# EAGLE design Me507Project (EAGLE 7.7.0)
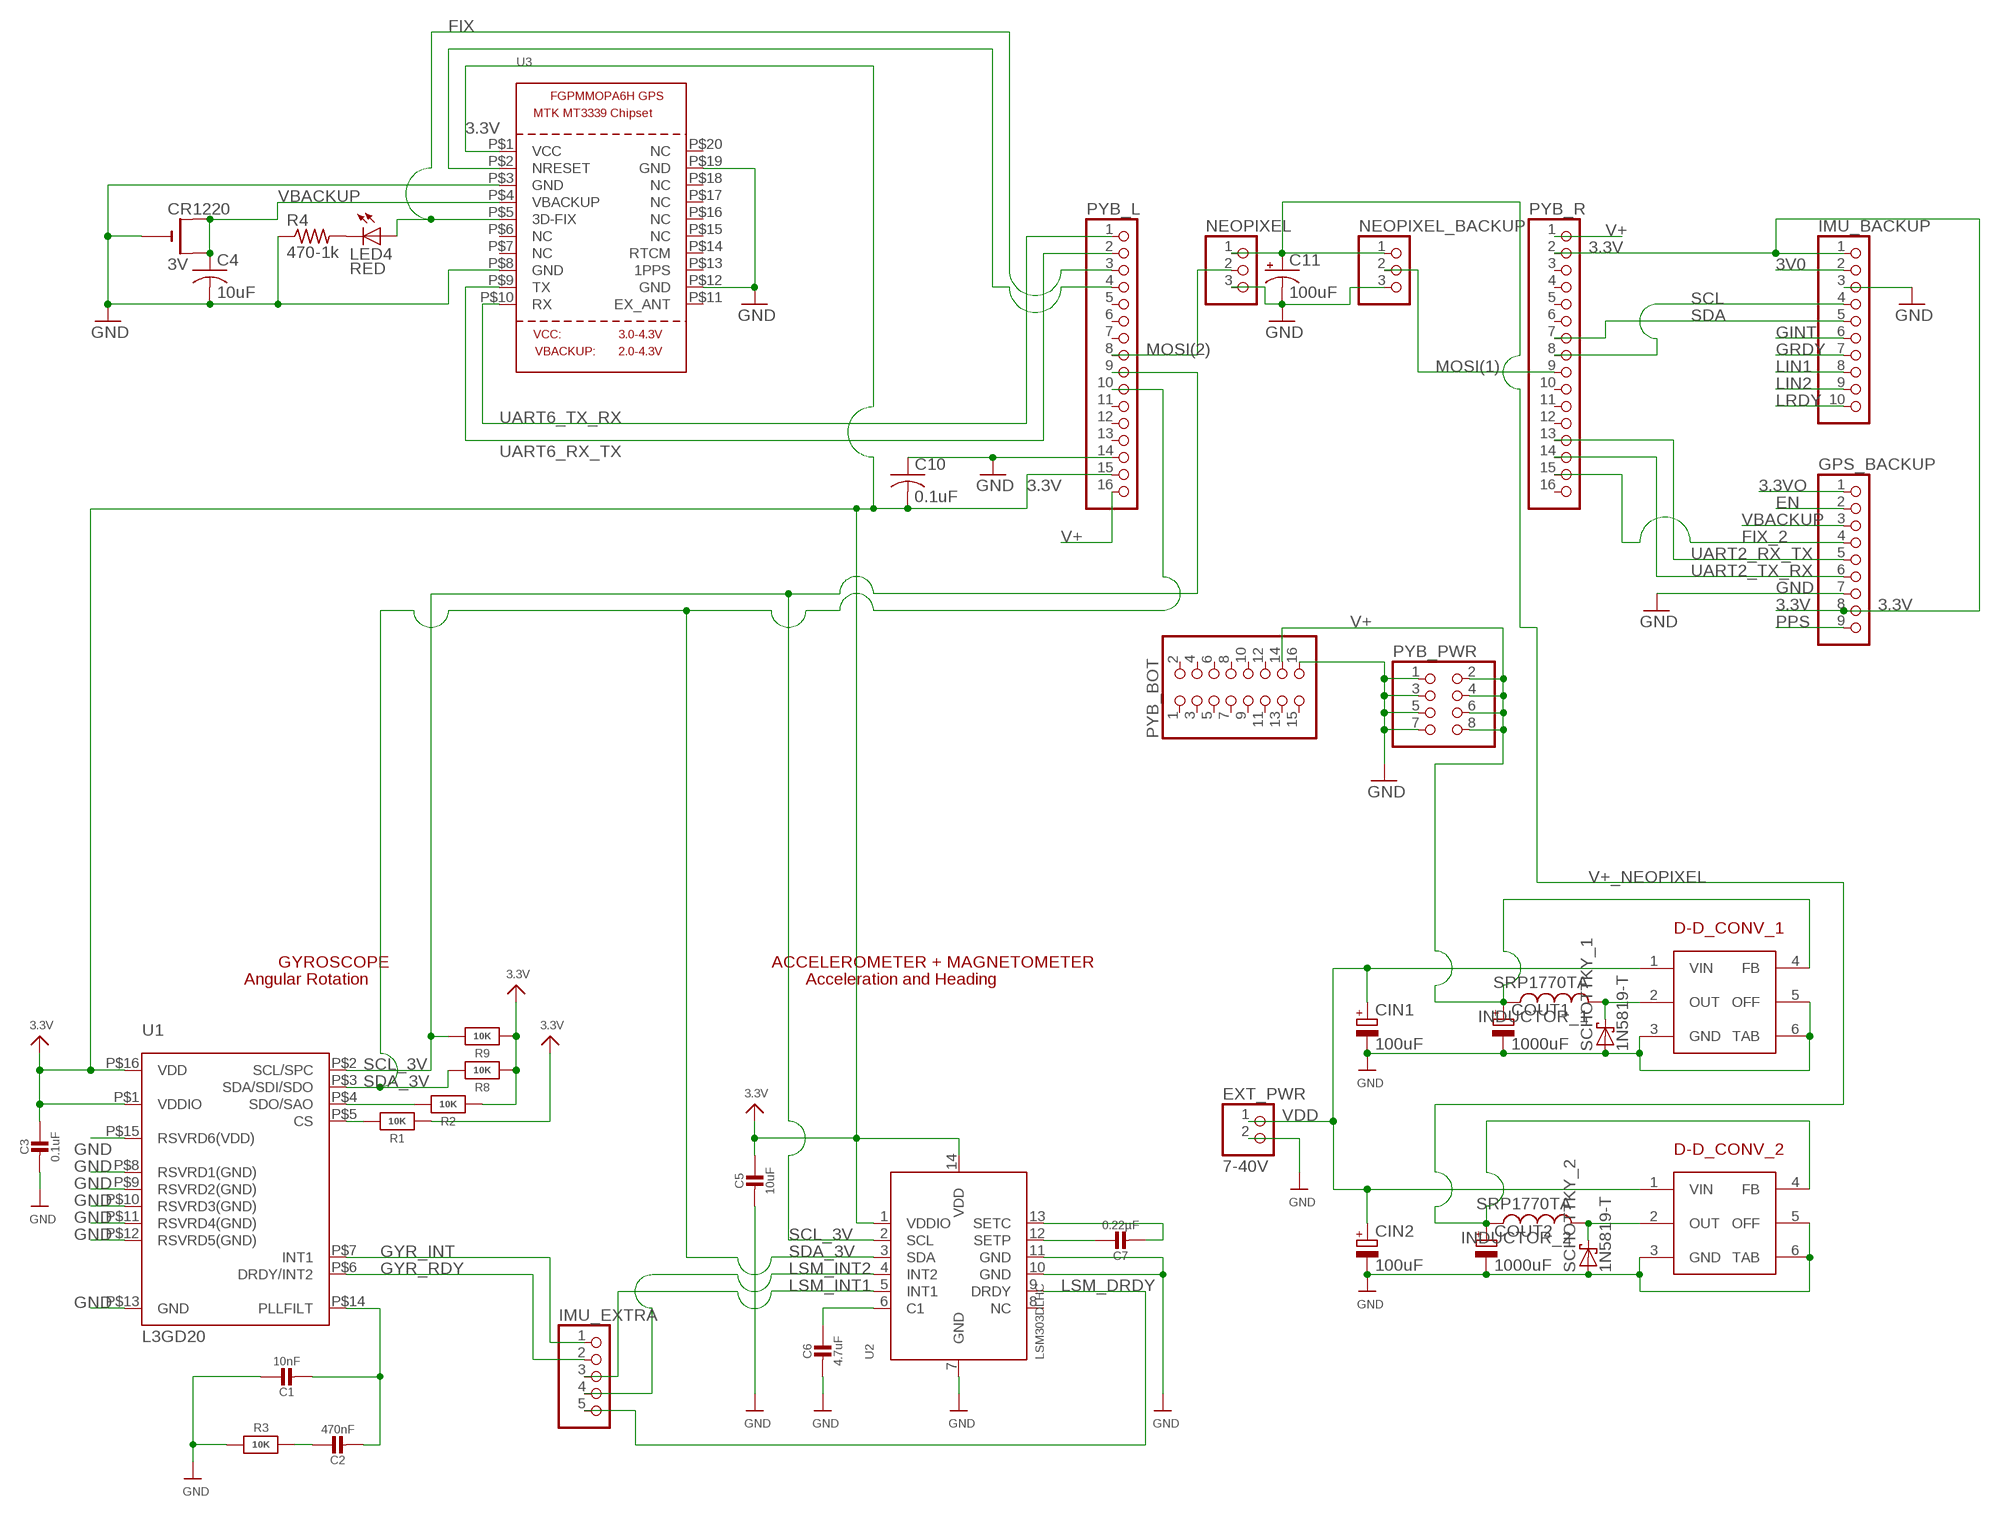
[diagram p0: schematic, sheet 1]

## Parts
C1  10nF  CAP_CERAMIC_0805MP  [_0805MP]
C2  470nF  CAP_CERAMIC_0805MP  [_0805MP]
C3  0.1uF  CAP_CERAMIC_0805MP  [_0805MP]
C4  10uF  C-USC0805K  [C0805K]
C5  10uF  CAP_CERAMIC_0805MP  [_0805MP]
C6  4.7uF  CAP_CERAMIC_0805MP  [_0805MP]
C7  0.22µF  CAP_CERAMIC_0805MP  [_0805MP]
C10  0.1uF  C-USC0805K  [C0805K]
C11  100uF  CPOL-US153CLV-0810  [153CLV-0810]
CIN1  100uF  CPOL-EUUD-8X10  [UD-8X10_NICHICON]
CIN2  100uF  CPOL-EUUD-8X10  [UD-8X10_NICHICON]
COUT1  1000uF  CPOL-EUE5-13  [E5-13]
COUT2  1000uF  CPOL-EUE5-13  [E5-13]
CR1220  3V  CR1220SMT  [CR1220-SMD]
D-D_CONV_1  AP3003  [TO263-5]
D-D_CONV_2  AP3003  [TO263-5]
EXT_PWR  7-40V  PINHD-1X2  [1X02]
GPS_BACKUP  PINHD-1X9  [1X09]
IMU_BACKUP  PINHD-1X10  [1X10]
IMU_EXTRA  PINHD-1X5  [1X05]
INDUCTOR_1  SRP1770TA  [SRP1770TA]
INDUCTOR_2  SRP1770TA  [SRP1770TA]
LED4  RED  LEDCHIP-LED0805  [CHIP-LED0805]
NEOPIXEL  PINHD-1X3  [1X03]
NEOPIXEL_BACKUP  PINHD-1X3  [1X03]
PYB_BOT  PINHD-2X8  [2X08]
PYB_L  PINHD-1X16  [1X16]
PYB_PWR  PINHD-2X4  [2X04]
PYB_R  PINHD-1X16  [1X16]
R1  10K  RESISTOR_0805MP  [_0805MP]
R2  10K  RESISTOR_0805MP  [_0805MP]
R3  10K  RESISTOR_0805MP  [_0805MP]
R4  470-1k  R-US_R0805  [R0805]
R8  10K  RESISTOR_0805MP  [_0805MP]
R9  10K  RESISTOR_0805MP  [_0805MP]
SCHOTTKY_1  1N5819-T  [DO41-7.6]
SCHOTTKY_2  1N5819-T  [DO41-7.6]
U1  L3GD20  GYRO_L3G2400D  [L3G4200D_LGA16L]
U2  LSM303DLHC  [LGA14]
U3  GPS_FGPMMOPA6H  [FGPMMOPA6H]

## Nets
3.3V: C3.1 C5.1 C10.2 GPS_BACKUP.8 IMU_BACKUP.1 PYB_L.15 PYB_R.2 R1.1 R2.1 R8.1 R9.1 U1.P$1(VDDIO) U1.P$16(VDD) U2.1(VDDIO) U2.14(VDD) U3.P$1(VCC)
3.3VO: GPS_BACKUP.1
3V0: IMU_BACKUP.2
EN: GPS_BACKUP.2
FIX: LED4.A PYB_L.3 U3.P$5(3D-FIX)
FIX_2: GPS_BACKUP.4 PYB_R.15
GINT: IMU_BACKUP.6
GND: C1.1 C3.2 C4.2 C5.2 C6.2 C10.1 C11.- CIN1.- CIN2.- COUT1.- COUT2.- CR1220.- D-D_CONV_1.3(GND) D-D_CONV_1.5(OFF) D-D_CONV_1.6(TAB) D-D_CONV_2.3(GND) D-D_CONV_2.5(OFF) D-D_CONV_2.6(TAB) EXT_PWR.2 GPS_BACKUP.7 IMU_BACKUP.3 NEOPIXEL.3 NEOPIXEL_BACKUP.3 PYB_BOT.16 PYB_L.14 PYB_PWR.1 PYB_PWR.3 PYB_PWR.5 PYB_PWR.7 R3.1 R4.1 SCHOTTKY_1.A SCHOTTKY_2.A U1.P$8(RSVRD1(GND)) U1.P$9(RSVRD2(GND)) U1.P$10(RSVRD3(GND)) U1.P$11(RSVRD4(GND)) U1.P$12(RSVRD5(GND)) U1.P$13(GND) U1.P$15(RSVRD6(VDD)) U2.7(GND) U2.10(GND) U2.11(GND) U3.P$3(GND) U3.P$8(GND) U3.P$12(GND) U3.P$19(GND)
GRDY: IMU_BACKUP.7
GYR_INT: IMU_EXTRA.1 U1.P$7(INT1)
GYR_RDY: IMU_EXTRA.2 U1.P$6(DRDY/INT2)
LIN1: IMU_BACKUP.8
LIN2: IMU_BACKUP.9
LRDY: IMU_BACKUP.10
LSM_DRDY: IMU_EXTRA.5 U2.9(DRDY)
LSM_INT1: IMU_EXTRA.3 U2.5(INT1)
LSM_INT2: IMU_EXTRA.4 U2.4(INT2)
MOSI(1): NEOPIXEL_BACKUP.2 PYB_R.9
MOSI(2): NEOPIXEL.2 PYB_L.8
N$1: R1.2 U1.P$5(CS)
N$2: R2.2 U1.P$4(SDO/SAO)
N$3: C2.1 R3.2
N$4: C1.2 C2.2 U1.P$14(PLLFILT)
N$5: C7.1 U2.12(SETP)
N$6: C6.1 U2.6(C1)
N$7: C7.2 U2.13(SETC)
N$8: LED4.C R4.2
N$10: D-D_CONV_2.2(OUT) INDUCTOR_2.P$4 SCHOTTKY_2.C
N$15: PYB_L.4 U3.P$2(NRESET)
N$16: D-D_CONV_1.2(OUT) INDUCTOR_1.P$4 SCHOTTKY_1.C
PPS: GPS_BACKUP.9
SCL: IMU_BACKUP.4 PYB_R.8
SCL_3V: PYB_L.9 R9.2 U1.P$2(SCL/SPC) U2.2(SCL)
SDA: IMU_BACKUP.5 PYB_R.7
SDA_3V: PYB_L.10 R8.2 U1.P$3(SDA/SDI/SDO) U2.3(SDA)
UART2_RX_TX: GPS_BACKUP.5 PYB_R.13
UART2_TX_RX: GPS_BACKUP.6 PYB_R.14
UART6_RX_TX: PYB_L.2 U3.P$9(TX)
UART6_TX_RX: PYB_L.1 U3.P$10(RX)
V+: COUT1.+ D-D_CONV_1.4(FB) INDUCTOR_1.P$3 PYB_BOT.14 PYB_L.16 PYB_PWR.2 PYB_PWR.4 PYB_PWR.6 PYB_PWR.8 PYB_R.1
V+_NEOPIXEL: C11.+ COUT2.+ D-D_CONV_2.4(FB) INDUCTOR_2.P$3 NEOPIXEL.1 NEOPIXEL_BACKUP.1
VBACKUP: C4.1 CR1220.+$1(+) CR1220.+$2(+1) GPS_BACKUP.3 U3.P$4(VBACKUP)
VDD: CIN1.+ CIN2.+ D-D_CONV_1.1(VIN) D-D_CONV_2.1(VIN) EXT_PWR.1
Unconnected: PYB_BOT.1 PYB_BOT.2 PYB_BOT.3 PYB_BOT.4 PYB_BOT.5 PYB_BOT.6 PYB_BOT.7 PYB_BOT.8 PYB_BOT.9 PYB_BOT.10 PYB_BOT.11 PYB_BOT.12 PYB_BOT.13 PYB_BOT.15 PYB_L.5 PYB_L.6 PYB_L.7 PYB_L.11 PYB_L.12 PYB_L.13 PYB_R.3 PYB_R.4 PYB_R.5 PYB_R.6 PYB_R.10 PYB_R.11 PYB_R.12 PYB_R.16 U2.8(NC) U3.P$6(NC) U3.P$7(NC) U3.P$11(EX_ANT) U3.P$13(1PPS) U3.P$14(RTCM) U3.P$15(NC) U3.P$16(NC) U3.P$17(NC) U3.P$18(NC) U3.P$20(NC)

## Notes on the sheet
- GYROSCOPE | ACCELEROMETER + MAGNETOMETER
- Angular Rotation | Acceleration and Heading

## Library data of the parts
C1-C3 C5-C7 = microbuilder:CAP_CERAMIC: Ceramic Capacitors For new designs, use the packages preceded by an '_' character since they are more reliable: The following footprints should be used on most boards: _0402 - Standard footprint for regular board layouts _0603 - Standard footprint for regular board layouts _0805 - Standard footprint for regular board layouts _1206 - Standard footprint for regular board layouts For extremely tight-pitch boards where space is at a premium, the following 'micro-pitch' footprints can be used (smaller pads, no silkscreen outline, etc.): _0402MP - Micro-pitch footprint for very dense/compact boards _0603MP - Micro-pitch footprint for very dense/compact boards _0805MP - Micro-pitch footprint for very dense/compact boards _1206MP - Micro-pitch footprint for very dense/compact boards
C4 C10 = rcl:C-US: CAPACITOR, American symbol
C11 = rcl:CPOL-US: POLARIZED CAPACITOR, American symbol
CIN1 CIN2 COUT1 COUT2 = rcl:CPOL-EU: POLARIZED CAPACITOR, European symbol
CR1220 = adafruit:CR1220: CR1216/CR1220/CR1225 12mm 3V lithium coin cell Great for battery packup. Both SMT and THM holders. Note the THM package has the ground pads on both sides of the PCB so that the masks are the same - this reduces the cost
D-D_CONV_1 D-D_CONV_2 = microbuilder:AP3003: MPN: LM2576HVSX-5.0/NOPB Digi-Key: LM2576HVSX-5.0/NOPBCT-ND Description: Buck Switching Regulator IC Positive Fixed 5V 1 Output 3A TO-263-6, D²Pak (5 Leads + Tab), TO-263BA
EXT_PWR = pinhead:PINHD-1X2: PIN HEADER
GPS_BACKUP = pinhead:PINHD-1X9: PIN HEADER
IMU_BACKUP = pinhead:PINHD-1X10: PIN HEADER
IMU_EXTRA = pinhead:PINHD-1X5: PIN HEADER
INDUCTOR_1 INDUCTOR_2 = Custom Library:SRP1770TA
LED4 = led:LED: LED OSRAM: - CHIPLED LG R971, LG N971, LY N971, LG Q971, LY Q971, LO R971, LY R971 LH N974, LH R974 LS Q976, LO Q976, LY Q976 LO Q996 - Hyper CHIPLED LW Q18S LB Q993, LB Q99A, LB R99A - SideLED LS A670, LO A670, LY A670, LG A670, LP A670 LB A673, LV A673, LT A673, LW A673 LH A674 LY A675 LS A676, LA A676, LO A676, LY A676, LW A676 LS A679, LY A679, LG A679 - Hyper Micro SIDELED® LS Y876, LA Y876, LO Y876, LY Y876 LT Y87S - SmartLED LW L88C, LW L88S LB L89C, LB L89S, LG L890 LS L89K, LO L89K, LY L89K LS L896, LA L896, LO L896, LY L896 - TOPLED LS T670, LO T670, LY T670, LG T670, LP T670 LSG T670, LSP T670, LSY T670, LOP T670, LYG T670 LG T671, LOG T671, LSG T671 LB T673, LV T673, LT T673, LW T673 LH T674 LS T676, LA T676, LO T676, LY T676, LB T676, LH T676, LSB T676, LW T676 LB T67C, LV T67C, LT T67C, LS T67K, LO T67K, LY T67K, LW E67C LS E67B, LA E67B, LO E67B, LY E67B, LB E67C, LV E67C, LT E67C LW T67C LS T679, LY T679, LG T679 LS T770, LO T770, LY T770, LG T770, LP T770 LB T773, LV T773, LT T773, LW T773 LH T774 LS E675, LA E675, LY E675, LS T675 LS T776, LA T776, LO T776, LY T776, LB T776 LHGB T686 LT T68C, LB T68C - Hyper Mini TOPLED® LB M676 - Mini TOPLED Santana® LG M470 LS M47K, LO M47K, LY M47K Source: http://www.osram.convergy.de LUXEON: - LUMILED® LXK2-PW12-R00, LXK2-PW12-S00, LXK2-PW14-U00, LXK2-PW14-V00 LXK2-PM12-R00, LXK2-PM12-S00, LXK2-PM14-U00 LXK2-PE12-Q00, LXK2-PE12-R00, LXK2-PE12-S00, LXK2-PE14-T00, LXK2-PE14-U00 LXK2-PB12-K00, LXK2-PB12-L00, LXK2-PB12-M00, LXK2-PB14-N00, LXK2-PB14-P00, LXK2-PB14-Q00 LXK2-PR12-L00, LXK2-PR12-M00, LXK2-PR14-Q00, LXK2-PR14-R00 LXK2-PD12-Q00, LXK2-PD12-R00, LXK2-PD12-S00 LXK2-PH12-R00, LXK2-PH12-S00 LXK2-PL12-P00, LXK2-PL12-Q00, LXK2-PL12-R00 Source: www.luxeon.com KINGBRIGHT: KA-3528ASYC Source: www.kingbright.com
NEOPIXEL NEOPIXEL_BACKUP = pinhead:PINHD-1X3: PIN HEADER
PYB_BOT = pinhead:PINHD-2X8: PIN HEADER
PYB_L PYB_R = pinhead:PINHD-1X16: PIN HEADER
PYB_PWR = pinhead:PINHD-2X4: PIN HEADER
R1-R3 R8 R9 = microbuilder:RESISTOR: Resistors For new designs, use the packages preceded by an '_' character since they are more reliable: The following footprints should be used on most boards: _0402 - Standard footprint for regular board layouts _0603 - Standard footprint for regular board layouts _0805 - Standard footprint for regular board layouts _1206 - Standard footprint for regular board layouts For extremely tight-pitch boards where space is at a premium, the following 'micro-pitch' footprints can be used (smaller pads, no silkscreen outline, etc.): _0402MP - Micro-pitch footprint for very dense/compact boards _0603MP - Micro-pitch footprint for very dense/compact boards _0805MP - Micro-pitch footprint for very dense/compact boards _1206MP - Micro-pitch footprint for very dense/compact boards
R4 = rcl:R-US_: RESISTOR, American symbol
SCHOTTKY_1 SCHOTTKY_2 = diode:1N581*: 1.0A SCHOTTKY BARRIER RECTIFIER Source: http://www.diodes.com/datasheets/ds23001.pdf
U1 = microbuilder:GYRO_L3G2400D: L3G4200D - 3-Axis MEMS gyroscope/motion sensor Note: Same footprint works for the newer L3DG20 gyroscope Three selectable scales: 250/500/2000 dps 1²C/SPI Interface 16-bit data 8-bit temperature VDD: 2.4-3.6V (IO 1.8V compatible) -40°C-85°C
U2 = microbuilder:LSM303DLHC: LSM303DLHC 3-Axis I2C Accelerometer and 3-Axis Magnetometer VDD: 2.2-3.6V VDDIO: 1.8-VDD Magnetic Range: +/-1.3 to +/-8.1 gauss Accel Range: +/-2/4/8/16 g Temp: -40 - 85°C
U3 = adafruit:GPS_FGPMMOPA6H: GPS Module - MTK MT3339 Chipset, -165dBm sensitivity, 22 channels, 10Hz, auto-select external antenna options

## Board
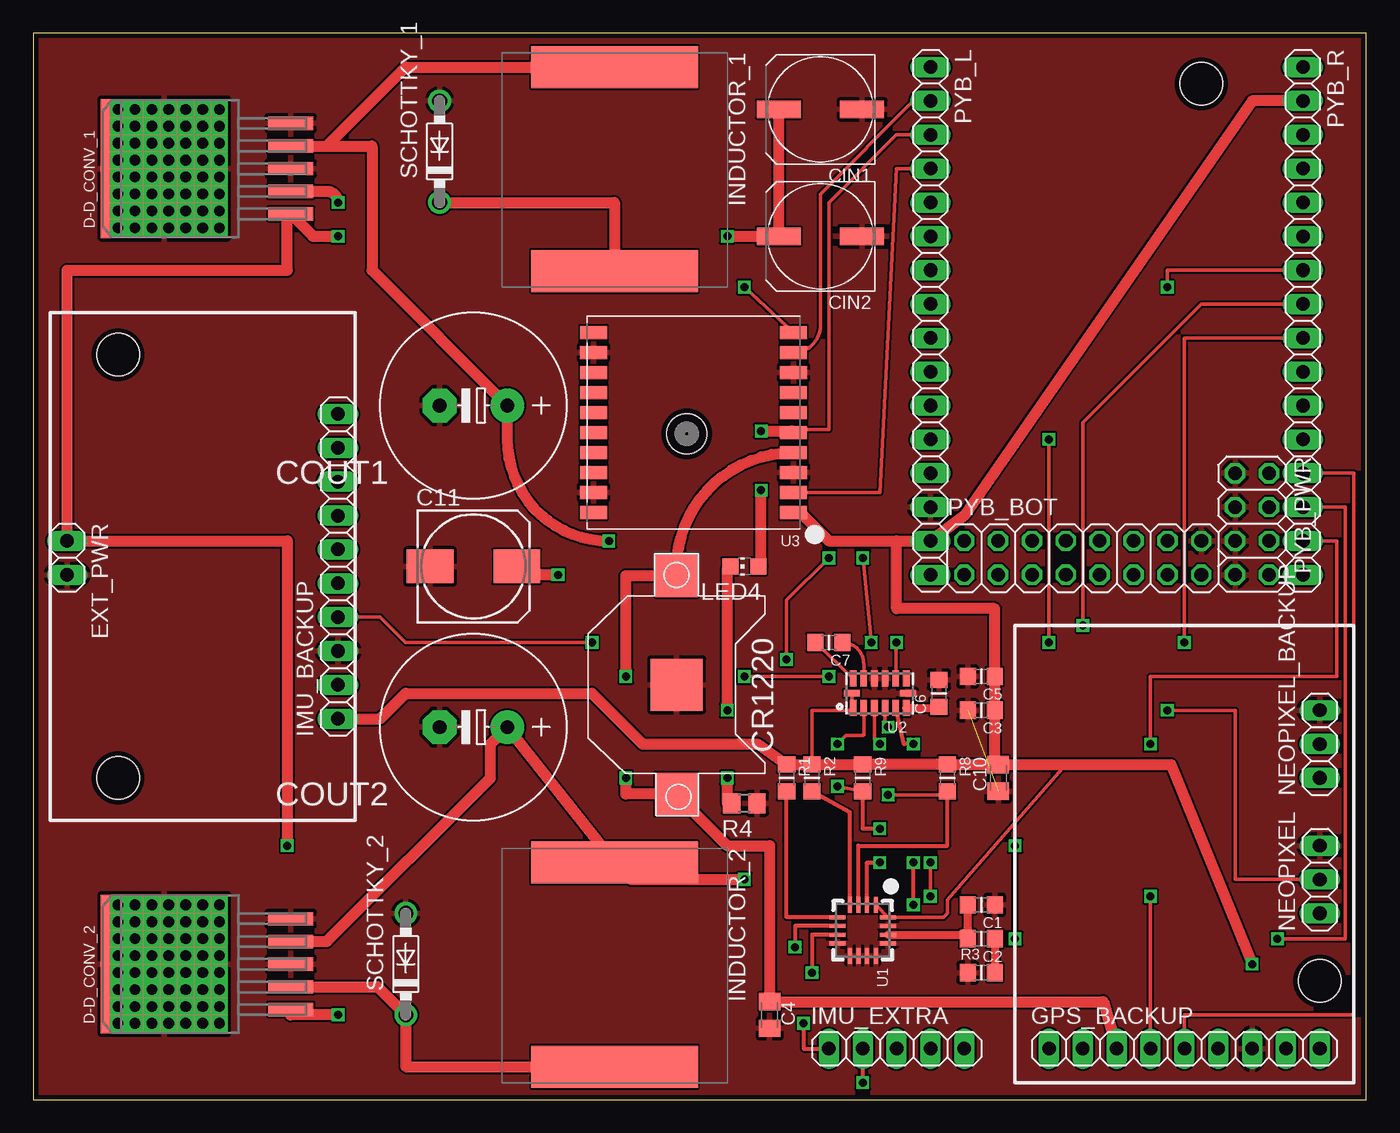
[diagram p1: board, top side]
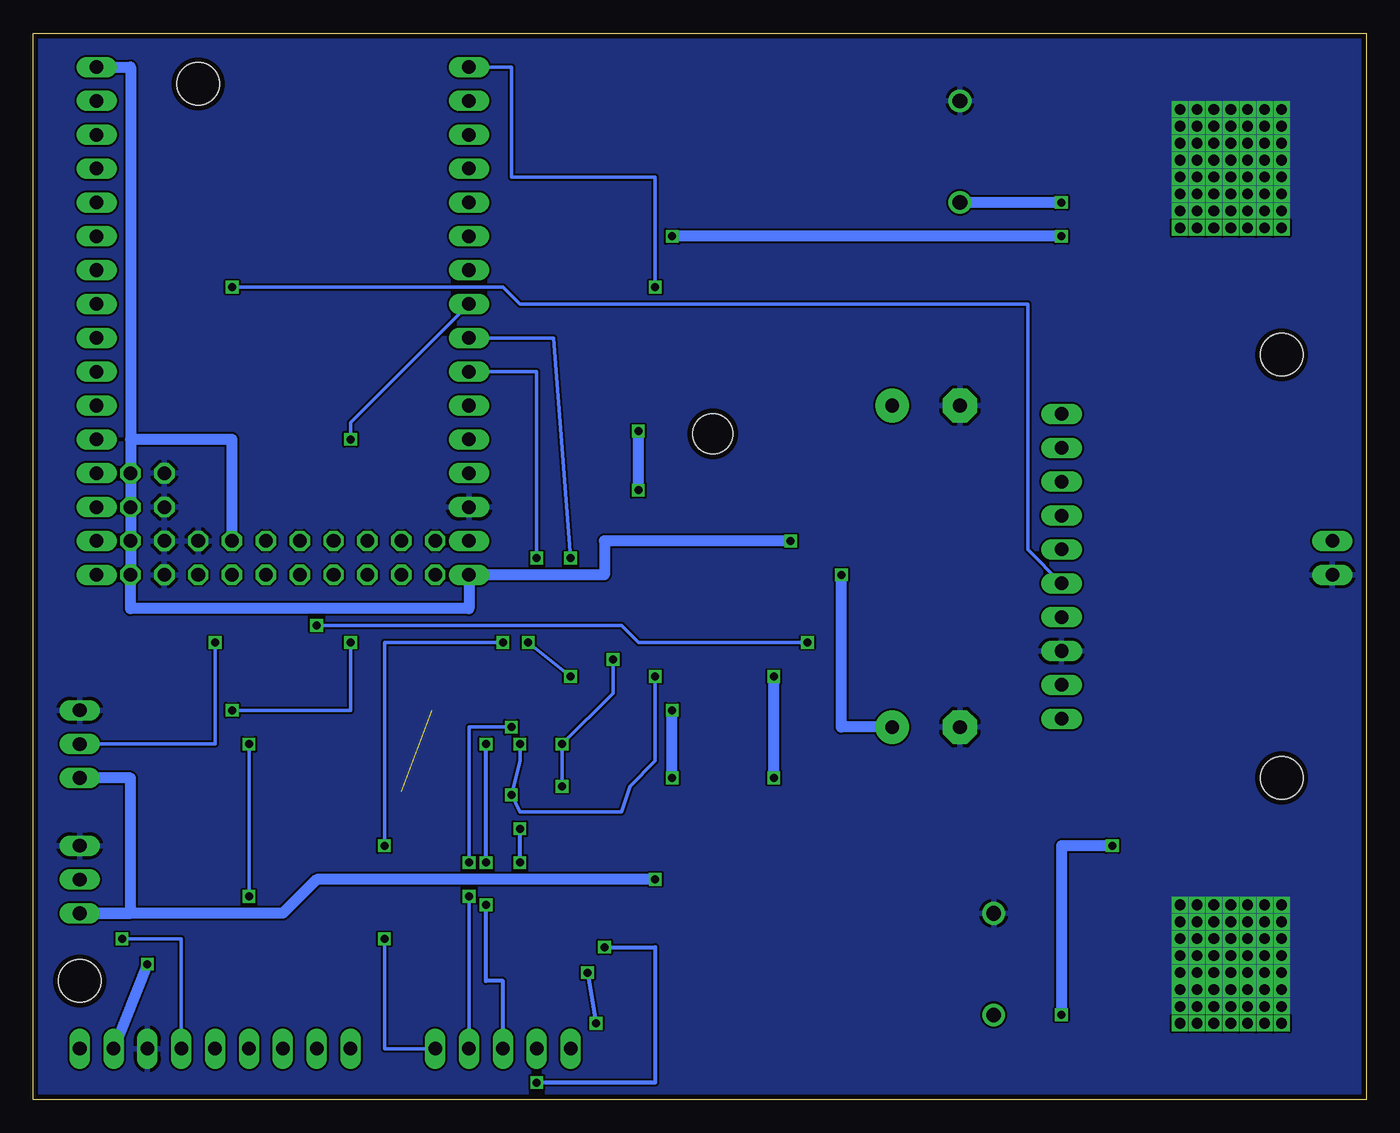
[diagram p2: board, bottom side, seen from below]

Size 100 x 80 mm. Coordinates in mm from the lower left corner, seen from the top.
Outline: 0,0 100,0 100,80 0,80 0,0
Copper layers (1*16): Top 0.0356mm / dielectric 1.5011mm / Bottom 0.0356mm
Design rules "LaenPCBOrder": minimum track width 6mil, minimum drill 13mil, track to track 6mil, track to pad 6mil, pad to pad 6mil, via to via 6mil, smd to smd 6mil, copper to edge 15mil, drill to drill 6mil, minimum pad ring 7mil, minimum via ring 7mil, stop-mask expansion 3mil, vias tented up to drill 0mil, thermal gap 10mil
Holes 3.2 mm at 6.35,24.13 6.35,55.88 96.52,8.89 87.63,76.2

### Footprints (pad centres in the part's own frame; a part is rotated, then mirrored left to right if it is on the bottom)
_0805MP = smd 1.2 x 1.3: 1 -1.016,0; 2 1.016,0
C0805K = smd 1.3 x 1.6: 1 -1,0; 2 1,0
153CLV-0810 = smd 3.5 x 2.5: + 3.25,0; - -3.25,0
UD-8X10_NICHICON = smd 3.3 x 1.3: + 3.125,0; - -3.125,0
E5-13 = drill 1.016 pad 2.54: + -2.54,0 | drill 1.016 pad 2.54 octagon: - 2.54,0
CR1220-SMD = smd 3.2 x 3.2: +$1 -8.2,0; +$2 8.2,0 | smd 3.9 x 3.9: - 0,0
TO263-5 = smd 1 x 3.4: 1 -3.4,-7.875; 2 -1.7,-7.875; 3 0,-7.875; 4 1.7,-7.875; 5 3.4,-7.875 | smd 10.414 x 9.525: 6 0,1.595
1X02 = drill 1.016 long: 1 -1.27,0; 2 1.27,0
1X09 = drill 1.016 long: 1 -10.16,0; 2 -7.62,0; 3 -5.08,0; 4 -2.54,0; 5 0,0; 6 2.54,0; 7 5.08,0; 8 7.62,0; 9 10.16,0
1X10 = drill 1.016 long: 1 -11.43,0; 2 -8.89,0; 3 -6.35,0; 4 -3.81,0; 5 -1.27,0; 6 1.27,0; 7 3.81,0; 8 6.35,0; 9 8.89,0; 10 11.43,0
1X05 = drill 1.016 long: 1 -5.08,0; 2 -2.54,0; 3 0,0; 4 2.54,0; 5 5.08,0
SRP1770TA = smd 3.15 x 12.5: P$3 -7.62,0.42; P$4 7.69,0.42
CHIP-LED0805 = smd 1.2 x 1.2: A 0,-1.05; C 0,1.05
1X03 = drill 1.016 long: 1 -2.54,0; 2 0,0; 3 2.54,0
2X08 = drill 1.016 octagon: 1 -8.89,-1.27; 2 -8.89,1.27; 3 -6.35,-1.27; 4 -6.35,1.27; 5 -3.81,-1.27; 6 -3.81,1.27; 7 -1.27,-1.27; 8 -1.27,1.27; 9 1.27,-1.27; 10 1.27,1.27; 11 3.81,-1.27; 12 3.81,1.27; 13 6.35,-1.27; 14 6.35,1.27; 15 8.89,-1.27; 16 8.89,1.27
1X16 = drill 1.016 long: 1 -19.05,0; 2 -16.51,0; 3 -13.97,0; 4 -11.43,0; 5 -8.89,0; 6 -6.35,0; 7 -3.81,0; 8 -1.27,0; 9 1.27,0; 10 3.81,0; 11 6.35,0; 12 8.89,0; 13 11.43,0; 14 13.97,0; 15 16.51,0; 16 19.05,0
2X04 = drill 1.016 octagon: 1 -3.81,-1.27; 2 -3.81,1.27; 3 -1.27,-1.27; 4 -1.27,1.27; 5 1.27,-1.27; 6 1.27,1.27; 7 3.81,-1.27; 8 3.81,1.27
R0805 = smd 1.3 x 1.5: 1 -0.95,0; 2 0.95,0
DO41-7.6 = drill 1.1 pad 1.7: A 3.81,0; C -3.81,0
L3G4200D_LGA16L = smd 1.2 x 0.3: P$1 -1.9,0.975; P$2 -1.9,0.325; P$3 -1.9,-0.325; P$4 -1.9,-0.975; P$9 1.9,-0.975; P$10 1.9,-0.325; P$11 1.9,0.325; P$12 1.9,0.975 | smd 0.3 x 1.2: P$5 -0.975,-1.9; P$6 -0.325,-1.9; P$7 0.325,-1.9; P$8 0.975,-1.9; P$13 0.975,1.9; P$14 0.325,1.9; P$15 -0.325,1.9; P$16 -0.975,1.9
LGA14 = smd 0.5 x 1.2: 1 2,1.1; 2 1.2,1.1; 3 0.4,1.1; 4 -0.4,1.1; 5 -1.2,1.1; 6 -2,1.1; 8 -2,-1.1; 9 -1.2,-1.1; 10 -0.4,-1.1; 11 0.4,-1.1; 12 1.2,-1.1; 13 2,-1.1 | smd 1.2 x 0.5: 7 -2.1,0; 14 2.1,0
FGPMMOPA6H = smd 2 x 1: P$1 -7.5,6.75; P$2 -7.5,5.25; P$3 -7.5,3.75; P$4 -7.5,2.25; P$5 -7.5,0.75; P$6 -7.5,-0.75; P$7 -7.5,-2.25; P$8 -7.5,-3.75; P$9 -7.5,-5.25; P$10 -7.5,-6.75; P$11 7.5,-6.75; P$12 7.5,-5.25; P$13 7.5,-3.75; P$14 7.5,-2.25; P$15 7.5,-0.75; P$16 7.5,0.75; P$17 7.5,2.25; P$18 7.5,3.75; P$19 7.5,5.25; P$20 7.5,6.75 | hole 3: 0.5,0.85

### Placement (x,y rotation side)
C1  71.12,14.61 180 top
C2  71.12,12.06 180 top
C3  71.12,29.21 180 top
C4  55.24,6.35 270 top
C5  71.12,31.75 180 top
C6  67.94,30.48 90 top
C7  59.69,34.29 180 top
C10  72.39,24.13 90 top
C11  33.02,40.01 0 top
CIN1  59.05,74.3 180 top
CIN2  59.05,64.77 180 top
COUT1  33.02,52.07 180 top
COUT2  33.02,27.94 180 top
CR1220  48.26,31.11 270 top
D-D_CONV_1  11.43,69.85 90 top
D-D_CONV_2  11.43,10.16 90 top
EXT_PWR  2.54,40.64 270 top
GPS_BACKUP  86.36,3.81 0 top
IMU_BACKUP  22.86,40.01 90 top
IMU_EXTRA  64.77,3.81 0 top
INDUCTOR_1  43.18,69.85 270 top
INDUCTOR_2  43.18,10.16 270 top
LED4  53.34,40.01 90 top
NEOPIXEL  96.52,16.51 90 top
NEOPIXEL_BACKUP  96.52,26.67 90 top
PYB_BOT  78.74,40.64 0 top
PYB_L  67.31,58.42 270 top
PYB_PWR  91.44,43.18 270 top
PYB_R  95.25,58.42 270 top
R1  56.52,24.13 270 top
R2  58.42,24.13 270 top
R3  71.12,9.53 0 top
R4  53.34,22.23 180 top
R8  68.58,24.13 270 top
R9  62.23,24.13 270 top
SCHOTTKY_1  30.48,71.12 90 top
SCHOTTKY_2  27.94,10.16 90 top
U1  62.23,12.7 270 top
U2  63.5,30.48 180 top
U3  49.53,50.8 180 top

### Tracks (layer width: path | path; a pad name or v marks a point on that pad's centre or on a via)
3.3V  (via drill 0.6)
  Top 0.254: 77.47,25.13 68.58,14.97 68.58,13.97 68.28,13.68 U1.P$16 U1.P$1 | U2.14 61.4,29.48 U2.1 61.33,29.21 58.42,29.21 R2.1
  Top 0.813: IMU_BACKUP.1 26.04,28.57 27.94,30.48 41.91,30.48 45.72,26.67 54.36,26.67 R1.1 R2.1 R9.1 R8.1 69.83,25.15 C10.2 | C10.2 77.47,25.13 85.36,25.13 v91.44,10.16 | PYB_R.2 91.44,74.93 69.85,43.81 PYB_L.15 64.77,41.91 | U3.P$1 57.55,44.05 59.69,41.91 64.77,41.91 | C10.2 72.14,25.13 C3.1 C5.1 72.14,36.83 64.77,36.83 64.77,41.91
  Bottom 0.813: v91.44,10.16 GPS_BACKUP.8
FIX  (via drill 0.6)
  Top 0.254: PYB_L.3 64.77,72.39 59.69,67.31 59.69,50.28 57.27,50.28 U3.P$5
  Top 0.813: LED4.A 54.61,40.01 v54.61,45.72 | v54.61,50.16 56.91,50.16 U3.P$5
  Bottom 0.813: v54.61,45.72 v54.61,50.16
FIX_2  (via drill 0.6)
  Top 0.254: PYB_R.15 97.79,41.91 97.79,31.75 83.82,31.75 v83.82,26.67 | v83.82,15.24 GPS_BACKUP.4
  Bottom 0.254: v83.82,26.67 v83.82,15.24
GND  (via drill 0.8)  (1 unrouted)
  other vias: 6.35,14.61 7.62,14.61 8.89,14.61 10.16,14.61 11.43,14.61 12.7,14.61 13.97,14.61 13.97,13.34 12.7,13.34 11.43,13.34 10.16,13.34 8.89,13.34 7.62,13.34 6.35,13.34 6.35,12.06 7.62,12.06 8.89,12.06 10.16,12.06 11.43,12.06 12.7,12.06 13.97,12.06 13.97,10.79 12.7,10.79 11.43,10.79 10.16,10.79 8.89,10.79 7.62,10.79 6.35,10.79 6.35,9.53 7.62,9.53 8.89,9.53 10.16,9.53 11.43,9.53 12.7,9.53 13.97,9.53 13.97,8.26 12.7,8.26 11.43,8.26 10.16,8.26 8.89,8.26 7.62,8.26 6.35,8.26 6.35,6.99 7.62,6.99 8.89,6.99 10.16,6.99 11.43,6.99 12.7,6.99 13.97,6.99 6.35,74.3 6.35,73.03 6.35,71.75 6.35,70.48 6.35,69.22 6.35,67.94 6.35,66.67 7.62,66.67 7.62,67.94 7.62,69.22 7.62,70.48 7.62,71.75 7.62,73.03 7.62,74.3 8.89,74.3 8.89,73.03 8.89,71.75 8.89,70.48 8.89,69.22 8.89,67.94 8.89,66.67 10.16,66.67 10.16,67.94 10.16,69.22 10.16,70.48 10.16,71.75 10.16,73.03 10.16,74.3 11.43,74.3 11.43,73.03 11.43,71.75 11.43,70.48 11.43,69.22 11.43,67.94 11.43,66.67 12.7,66.67 12.7,67.94 12.7,69.22 12.7,70.48 12.7,71.75 12.7,73.03 12.7,74.3 13.97,74.3 13.97,73.03 13.97,71.75 13.97,70.48 13.97,69.22 13.97,67.94 13.97,66.67
  pour Top: 100,0 100,80.01 0,80.01 0,0
  pour Bottom: 100,0 100,80.01 0,80.01 0,0
GYR_INT  (via drill 0.6)
  Top 0.305: U1.P$7 58.42,12.38 v58.42,9.53 | v57.78,5.71 57.78,3.81 IMU_EXTRA.1
  Bottom 0.305: v58.42,9.53 v57.78,5.71
GYR_RDY  (via drill 0.6)
  Top 0.305: U1.P$6 57.15,13.03 v57.15,11.43 | v62.23,1.27 IMU_EXTRA.2
  Bottom 0.305: v57.15,11.43 53.34,11.43 53.34,1.27 v62.23,1.27
LSM_DRDY  (via drill 0.6)
  Top 0.254: v64.77,34.29 64.7,34.29 U2.9 | v73.66,12.06 v73.66,19.05
  Bottom 0.254: IMU_EXTRA.5 73.66,3.81 v73.66,12.06 | v73.66,19.05 73.66,34.29 v64.77,34.29
LSM_INT1  (via drill 0.6)
  Top 0.305: v66.04,26.67 65.33,26.67 U2.5 | v66.04,14.61 v66.04,17.78
  Bottom 0.305: IMU_EXTRA.3 64.77,8.89 66.04,8.89 v66.04,14.61 | v66.04,17.78 v66.04,26.67
LSM_INT2  (via drill 0.6)
  Top 0.254: v67.31,15.24 v67.31,17.78 | v64.14,27.94 arc90 63.9,28.34 U2.4
  Bottom 0.254: IMU_EXTRA.4 v67.31,15.24 | v67.31,17.78 67.31,27.94 v64.14,27.94
MOSI(1)  (via drill 0.6)
  Top 0.254: v86.36,34.29 86.36,57.15 PYB_R.9
  Bottom 0.254: NEOPIXEL_BACKUP.2 86.36,26.67 v86.36,34.29
MOSI(2)  (via drill 0.6)
  Top 0.254: NEOPIXEL.2 90.17,16.51 90.17,29.21 v85.09,29.21 | v76.2,34.29 v76.2,49.53
  Bottom 0.254: v85.09,29.21 76.2,29.21 v76.2,34.29 | v76.2,49.53 76.2,50.8 PYB_L.8
N$1
  Top 0.305: U1.P$5 56.52,13.68 R1.2
N$2
  Top 0.305: U1.P$4 61.26,21.55 R2.2
N$3
  Top 0.61: C2.1 R3.2
N$4
  Top 0.61: U1.P$14 69.79,12.38 | C2.2 C1.2
  Top 0.813: 69.79,12.38 C2.2
N$5
  Top 0.254: U2.12 62.3,32.7 arc90 C7.1
N$6
  Top 0.61: U2.6 67.94,29.38
  Top 0.813: 67.94,29.38 C6.1
N$7
  Top 0.254: U2.13 C7.2
N$8  (via drill 0.6)
  Top 0.813: R4.2 52.07,22.23 v52.07,24.13 | v52.07,29.21 52.07,39.78 LED4.C
  Bottom 0.813: v52.07,24.13 v52.07,29.21
N$9  (via drill 0.8)
  other vias: 13.97,5.71
N$10
  Top 0.813: D-D_CONV_2.2 25.83,8.46 SCHOTTKY_2.C 27.94,2.47 INDUCTOR_2.P$4
N$11  (via drill 0.8)
  other vias: 12.7,5.71
N$12  (via drill 0.8)
  other vias: 11.43,5.71
N$13  (via drill 0.8)
  other vias: 6.35,5.71
N$14  (via drill 0.8)
  other vias: 8.89,5.71
N$15
  Top 0.254: U3.P$2 63.5,45.55 64.77,69.85 PYB_L.4
N$16  (via drill 0.6)
  Top 0.813: D-D_CONV_1.2 22.02,68.15 arc-90 v22.86,67.31 | SCHOTTKY_1.C 43.6,67.31 INDUCTOR_1.P$4
  Bottom 0.813: v22.86,67.31 SCHOTTKY_1.C
N$17  (via drill 0.8)
  other vias: 7.62,5.71
N$18  (via drill 0.8)
  other vias: 10.16,5.71
N$19  (via drill 0.8)
  other vias: 13.97,65.41
N$20  (via drill 0.8)
  other vias: 12.7,65.41
N$21  (via drill 0.8)
  other vias: 11.43,65.41
N$22  (via drill 0.8)
  other vias: 10.16,65.41
N$23  (via drill 0.8)
  other vias: 8.89,65.41
N$24  (via drill 0.8)
  other vias: 7.62,65.41
N$25  (via drill 0.8)
  other vias: 6.35,65.41
SCL  (via drill 0.6)
  Top 0.254: IMU_BACKUP.4 26.04,36.2 27.94,34.29 v41.91,34.29 | v78.74,35.56 78.74,50.8 87.63,59.69 PYB_R.8
  Bottom 0.254: v41.91,34.29 54.61,34.29 55.88,35.56 v78.74,35.56
SCL_3V  (via drill 0.6)
  Top 0.254: U2.2 62.3,27.38 62.23,27.3 60.96,27.3 v60.33,26.67 | v60.33,23.5 R9.2 | v59.69,40.64 56.52,37.47 v56.52,33.02
  Top 0.305: U1.P$2 62.55,17.78 v63.5,17.78 | v63.5,20.32 62.23,20.32 R9.2
  Bottom 0.254: v60.33,23.5 v60.33,26.67 56.52,30.48 v56.52,33.02 | PYB_L.9 60.96,57.15 v59.69,40.64
  Bottom 0.305: v63.5,17.78 v63.5,20.32
SDA  (via drill 0.6)
  Top 0.254: PYB_R.7 85.09,62.23 v85.09,60.96
  Bottom 0.254: v85.09,60.96 64.77,60.96 63.5,59.69 25.4,59.69 25.4,41.27 IMU_BACKUP.5
SDA_3V  (via drill 0.6)
  Top 0.254: R8.2 arc-90 68.33,22.86 v64.14,22.86 | U2.3 63.1,27.07 v63.5,26.67 | v62.23,40.64 v62.87,34.29 | v59.69,31.75 v53.34,31.75
  Top 0.305: U1.P$3 61.91,19.05 68.58,19.05 R8.2
  Bottom 0.254: v63.5,26.67 63.5,25.4 v64.14,22.86 63.5,21.59 55.88,21.59 55.24,23.5 53.34,25.4 v53.34,31.75 | PYB_L.10 62.23,54.61 v62.23,40.64 | v62.87,34.29 v59.69,31.75
UART2_RX_TX
  Top 0.254: PYB_R.13 99.06,46.99 99.06,6.35 86.36,6.35 GPS_BACKUP.5
UART2_TX_RX  (via drill 0.6)
  Top 0.254: PYB_R.14 98.42,44.45 98.42,12.06 v93.34,12.06
  Bottom 0.254: v93.34,12.06 88.9,12.06 GPS_BACKUP.6
UART6_RX_TX
  Top 0.254: U3.P$9 arc90 59.05,58.08 59.05,67.94 66.04,74.93 PYB_L.2
UART6_TX_RX  (via drill 0.6)
  Top 0.254: U3.P$10 v53.34,60.96
  Bottom 0.254: v53.34,60.96 53.34,69.22 64.14,69.22 64.14,77.47 PYB_L.1
V+  (via drill 0.6)
  Top 0.813: D-D_CONV_1.4 22.02,71.55 | 22.02,71.55 27.94,77.47 INDUCTOR_1.P$3 | 22.02,71.55 25.4,71.55 25.4,62.23 COUT1.+ 35.56,49.53 arc90 v43.18,41.91
  Bottom 0.813: v43.18,41.91 57.15,41.91 57.15,39.37 PYB_L.16 67.31,36.83 92.71,36.83 PYB_PWR.8 PYB_PWR.6 PYB_PWR.4 PYB_PWR.2 92.71,49.53 | PYB_R.1 92.71,77.47 92.71,49.53 | PYB_BOT.14 85.09,49.53 92.71,49.53
V+_NEOPIXEL  (via drill 0.6)
  Top 0.813: D-D_CONV_2.4 22.02,11.86 34.29,24.13 34.29,26.67 COUT2.+ INDUCTOR_2.P$3 44.87,16.51 v53.34,16.51 | v39.37,39.37 36.27,39.37 C11.+
  Bottom 0.813: v53.34,16.51 78.74,16.51 81.28,13.97 NEOPIXEL.1 92.71,13.97 92.71,24.13 NEOPIXEL_BACKUP.1 | COUT2.+ 39.37,27.94 v39.37,39.37
VBACKUP  (via drill 0.6)
  Top 0.813: GPS_BACKUP.3 80.28,7.35 C4.1 55.24,19.05 52.07,19.05 48.26,22.86 CR1220.+$2 44.45,22.91 v44.45,24.13 | v44.45,31.75 44.45,39.31 CR1220.+$1 48.26,39.78 arc-90 U3.P$4
  Bottom 0.813: v44.45,24.13 v44.45,31.75
VDD  (via drill 0.6)
  Top 0.813: v19.05,19.05 19.05,41.91 EXT_PWR.1 2.54,62.23 19.05,62.23 19.05,66.45 D-D_CONV_1.1 20.98,64.77 v22.86,64.77 | v22.86,6.35 19.3,6.35 D-D_CONV_2.1 | v52.07,64.77 CIN2.+ CIN1.+
  Bottom 0.813: v19.05,19.05 22.86,19.05 v22.86,6.35 | v22.86,64.77 v52.07,64.77